# Altium schematic sheet PMOD_IO.SchDoc: PMOD Expansion IO
size B; Engineer: M. Jones; Organization: Michael Jones; DocumentNumber: 6; Revision: RA.1; SheetNumber: 6; SheetTotal: 7
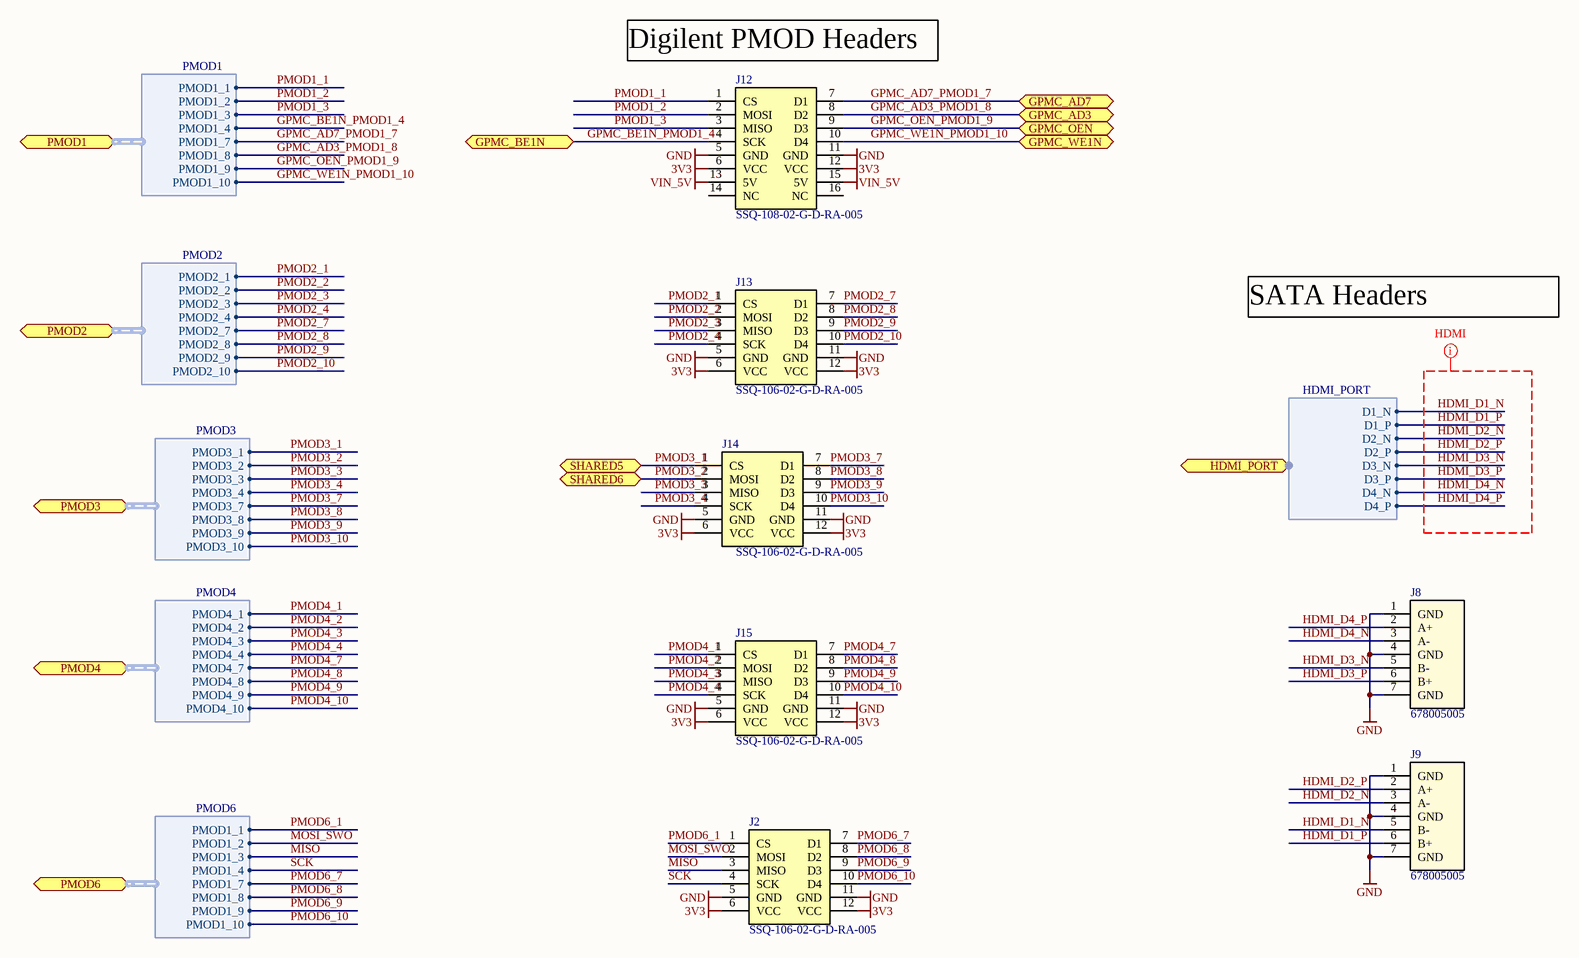
[diagram p0: PMOD_IO.SchDoc]

## Parts
J2  SSQ-106-02-G-D-RA-005  [PMOD HEADER - SSQ-106-02-G-D-RA]
J8  678005005  [SATA - 67800-5005]
J9  678005005  [SATA - 67800-5005]
J12  SSQ-108-02-G-D-RA-005  [PMOD HEADER8 - SSQ-108-02-G-D-RA]
J13  SSQ-106-02-G-D-RA-005  [PMOD HEADER - SSQ-106-02-G-D-RA]
J14  SSQ-106-02-G-D-RA-005  [PMOD HEADER - SSQ-106-02-G-D-RA]
J15  SSQ-106-02-G-D-RA-005  [PMOD HEADER - SSQ-106-02-G-D-RA]

## Ports
GPMC_AD3, GPMC_AD7, GPMC_BE1N, GPMC_OEN, GPMC_WE1N, HDMI_PORT (harness HDMI_PORT), PMOD1 (harness PMOD1), PMOD2 (harness PMOD2), PMOD3 (harness PMOD3), PMOD4 (harness PMOD4), PMOD6 (harness PMOD6), SHARED5, SHARED6

## Harnesses
PMOD1: PMOD1_1, PMOD1_2, PMOD1_3, PMOD1_4, PMOD1_7, PMOD1_8, PMOD1_9, PMOD1_10
PMOD2: PMOD2_1, PMOD2_2, PMOD2_3, PMOD2_4, PMOD2_7, PMOD2_8, PMOD2_9, PMOD2_10
PMOD3: PMOD3_1, PMOD3_2, PMOD3_3, PMOD3_4, PMOD3_7, PMOD3_8, PMOD3_9, PMOD3_10
PMOD4: PMOD4_1, PMOD4_2, PMOD4_3, PMOD4_4, PMOD4_7, PMOD4_8, PMOD4_9, PMOD4_10
PMOD6: PMOD1_1, PMOD1_2, PMOD1_3, PMOD1_4, PMOD1_7, PMOD1_8, PMOD1_9, PMOD1_10
HDMI_PORT: D1_P, D1_N, D2_N, D3_N, D4_N, D2_P, D3_P, D4_P

## Nets
3V3: J2.6(VCC) J2.12(VCC) J12.6(VCC) J12.12(VCC) J13.6(VCC) J13.12(VCC) J14.6(VCC) J14.12(VCC) J15.6(VCC) J15.12(VCC)
GND: J2.5(GND) J2.11(GND) J8.1(GND) J8.4(GND) J8.7(GND) J9.1(GND) J9.4(GND) J9.7(GND) J12.5(GND) J12.11(GND) J13.5(GND) J13.11(GND) J14.5(GND) J14.11(GND) J15.5(GND) J15.11(GND)
VIN_5V: J12.13(5V) J12.15(5V)
GPMC_AD3_PMOD1_8: J12.8(D2) ; port GPMC_AD3, port PMOD1.PMOD1_8
GPMC_AD7_PMOD1_7: J12.7(D1) ; port GPMC_AD7, port PMOD1.PMOD1_7
GPMC_BE1N_PMOD1_4: J12.4(SCK) ; port GPMC_BE1N, port PMOD1.PMOD1_4
GPMC_OEN_PMOD1_9: J12.9(D3) ; port GPMC_OEN, port PMOD1.PMOD1_9
GPMC_WE1N_PMOD1_10: J12.10(D4) ; port GPMC_WE1N, port PMOD1.PMOD1_10
HDMI_D1_N: J9.5(B-) ; port HDMI_PORT.D1_N
HDMI_D1_P: J9.6(B+) ; port HDMI_PORT.D1_P
HDMI_D2_N: J9.3(A-) ; port HDMI_PORT.D2_N
HDMI_D2_P: J9.2(A+) ; port HDMI_PORT.D2_P
HDMI_D3_N: J8.5(B-) ; port HDMI_PORT.D3_N
HDMI_D3_P: J8.6(B+) ; port HDMI_PORT.D3_P
HDMI_D4_N: J8.3(A-) ; port HDMI_PORT.D4_N
HDMI_D4_P: J8.2(A+) ; port HDMI_PORT.D4_P
MISO: J2.3(MISO) ; port PMOD6.PMOD1_3
MOSI_SWO: J2.2(MOSI) ; port PMOD6.PMOD1_2
PMOD1_1: J12.1(CS) ; port PMOD1.PMOD1_1
PMOD1_2: J12.2(MOSI) ; port PMOD1.PMOD1_2
PMOD1_3: J12.3(MISO) ; port PMOD1.PMOD1_3
PMOD2_1: J13.1(CS) ; port PMOD2.PMOD2_1
PMOD2_2: J13.2(MOSI) ; port PMOD2.PMOD2_2
PMOD2_3: J13.3(MISO) ; port PMOD2.PMOD2_3
PMOD2_4: J13.4(SCK) ; port PMOD2.PMOD2_4
PMOD2_7: J13.7(D1) ; port PMOD2.PMOD2_7
PMOD2_8: J13.8(D2) ; port PMOD2.PMOD2_8
PMOD2_9: J13.9(D3) ; port PMOD2.PMOD2_9
PMOD2_10: J13.10(D4) ; port PMOD2.PMOD2_10
PMOD3_1: J14.1(CS) ; port SHARED5, port PMOD3.PMOD3_1
PMOD3_2: J14.2(MOSI) ; port SHARED6, port PMOD3.PMOD3_2
PMOD3_3: J14.3(MISO) ; port PMOD3.PMOD3_3
PMOD3_4: J14.4(SCK) ; port PMOD3.PMOD3_4
PMOD3_7: J14.7(D1) ; port PMOD3.PMOD3_7
PMOD3_8: J14.8(D2) ; port PMOD3.PMOD3_8
PMOD3_9: J14.9(D3) ; port PMOD3.PMOD3_9
PMOD3_10: J14.10(D4) ; port PMOD3.PMOD3_10
PMOD4_1: J15.1(CS) ; port PMOD4.PMOD4_1
PMOD4_2: J15.2(MOSI) ; port PMOD4.PMOD4_2
PMOD4_3: J15.3(MISO) ; port PMOD4.PMOD4_3
PMOD4_4: J15.4(SCK) ; port PMOD4.PMOD4_4
PMOD4_7: J15.7(D1) ; port PMOD4.PMOD4_7
PMOD4_8: J15.8(D2) ; port PMOD4.PMOD4_8
PMOD4_9: J15.9(D3) ; port PMOD4.PMOD4_9
PMOD4_10: J15.10(D4) ; port PMOD4.PMOD4_10
PMOD6_1: J2.1(CS) ; port PMOD6.PMOD1_1
PMOD6_7: J2.7(D1) ; port PMOD6.PMOD1_7
PMOD6_8: J2.8(D2) ; port PMOD6.PMOD1_8
PMOD6_9: J2.9(D3) ; port PMOD6.PMOD1_9
PMOD6_10: J2.10(D4) ; port PMOD6.PMOD1_10
SCK: J2.4(SCK) ; port PMOD6.PMOD1_4

Not connected (* = marked no-connect by the designer): J12 14(NC) 16(NC)

## Layout directives
net class HDMI: HDMI_D1_N, HDMI_D1_P, HDMI_D2_N, HDMI_D2_P, HDMI_D3_N, HDMI_D3_P, HDMI_D4_N, HDMI_D4_P

## Notes on the sheet
- (near J12) Digilent PMOD Headers
- SATA Headers
- Title
- Revision:
- Sheet
- of
- Date:
- Engineer:

## Library data of the parts
J2 J13-J15 = P-MOD - SSQ-106-02-G-D-RA-005: SAMTEC - SSQ-106-02-G-D-RA-005 - 2MM SOCKET STRIPS; Supplier 1: Newark; Supplier Part Number 1: 81P8253; Manufacturer: SAMTEC; Manufacturer Part Number: SSQ-106-02-G-D-RA-005; Stock 1: 0; Pricing 1: 1=1.58, 20834=1.4, 41667=1.32 (USD); Value: SSQ-106-02-G-D-RA-005
J8 J9 = SATA - 67800-5005: I/O Connectors 7Ckt Vert Signal Hdr SMT w/ locking latch; Manufacturer: Molex; Current Rating: 1.5 A; Gender: Male; Mounting Angle: Vertical; Voltage Rating: 15 VDC; Pitch: 1.27 mm; Number of Positions / Contacts: 7; Supplier 1: Mouser; Manufacturer Part Number: 67800-5005; RoHS: RoHS Compliant; Category: I/O Connectors; Stock 1: 2502; Pricing 1: 1=1.05, 10=0.929, 25=0.837, 50=0.801, 100=0.728, 250=0.655, 500=0.582, 1000=0.528, 1500=0.524 (AUD); Color: Black; Contact Plating: Gold; Housing Material: Thermoplastic; Operating Temperature Range: - 35 C to + 85 C; Packaging: Tray; Product: SATA Connectors; Series: 67800; Termination Style: Solder Tail; Contact Material: Brass; Flammability Rating: UL 94 V-0; Mounting Style: Through Hole; Product Category: SAS / SATA Connectors; Standard Pack Qty: 4800; RoHS - Mouser: Y; Minimum Order Quantity: 1; Reeling: False; ComponentLink1URL: http://www.mouser.com/ds/1/276/0678005005_PCB_HEADERS-119857.pdf; ComponentLink1Description: http://www.mouser.com/ds/1/276/0678005005_PCB_HEADERS-119857.pdf; Supplier Part Number 1: 538-67800-5005; Value: 678005005
J12 = P-MOD - SSQ-108-02-G-D-RA-005: SAMTEC - SSQ-108-02-G-D-RA-005 - 2MM SOCKET STRIPS; Supplier 1: Newark; Supplier Part Number 1: 81P8253; Manufacturer: SAMTEC; Manufacturer Part Number: SSQ-108-02-G-D-RA-005; Stock 1: 0; Pricing 1: 1=1.58, 20834=1.4, 41667=1.32 (USD); Value: SSQ-108-02-G-D-RA-005